# Altium schematic sheet Main.SchDoc
size 420 x 297 mm; SheetNumber: 1; SheetTotal: 6; ENG_APP_DATE: --/--/--; DSN_APP_DATE: --/--/--; CHK_APP_DATE: --/--/--
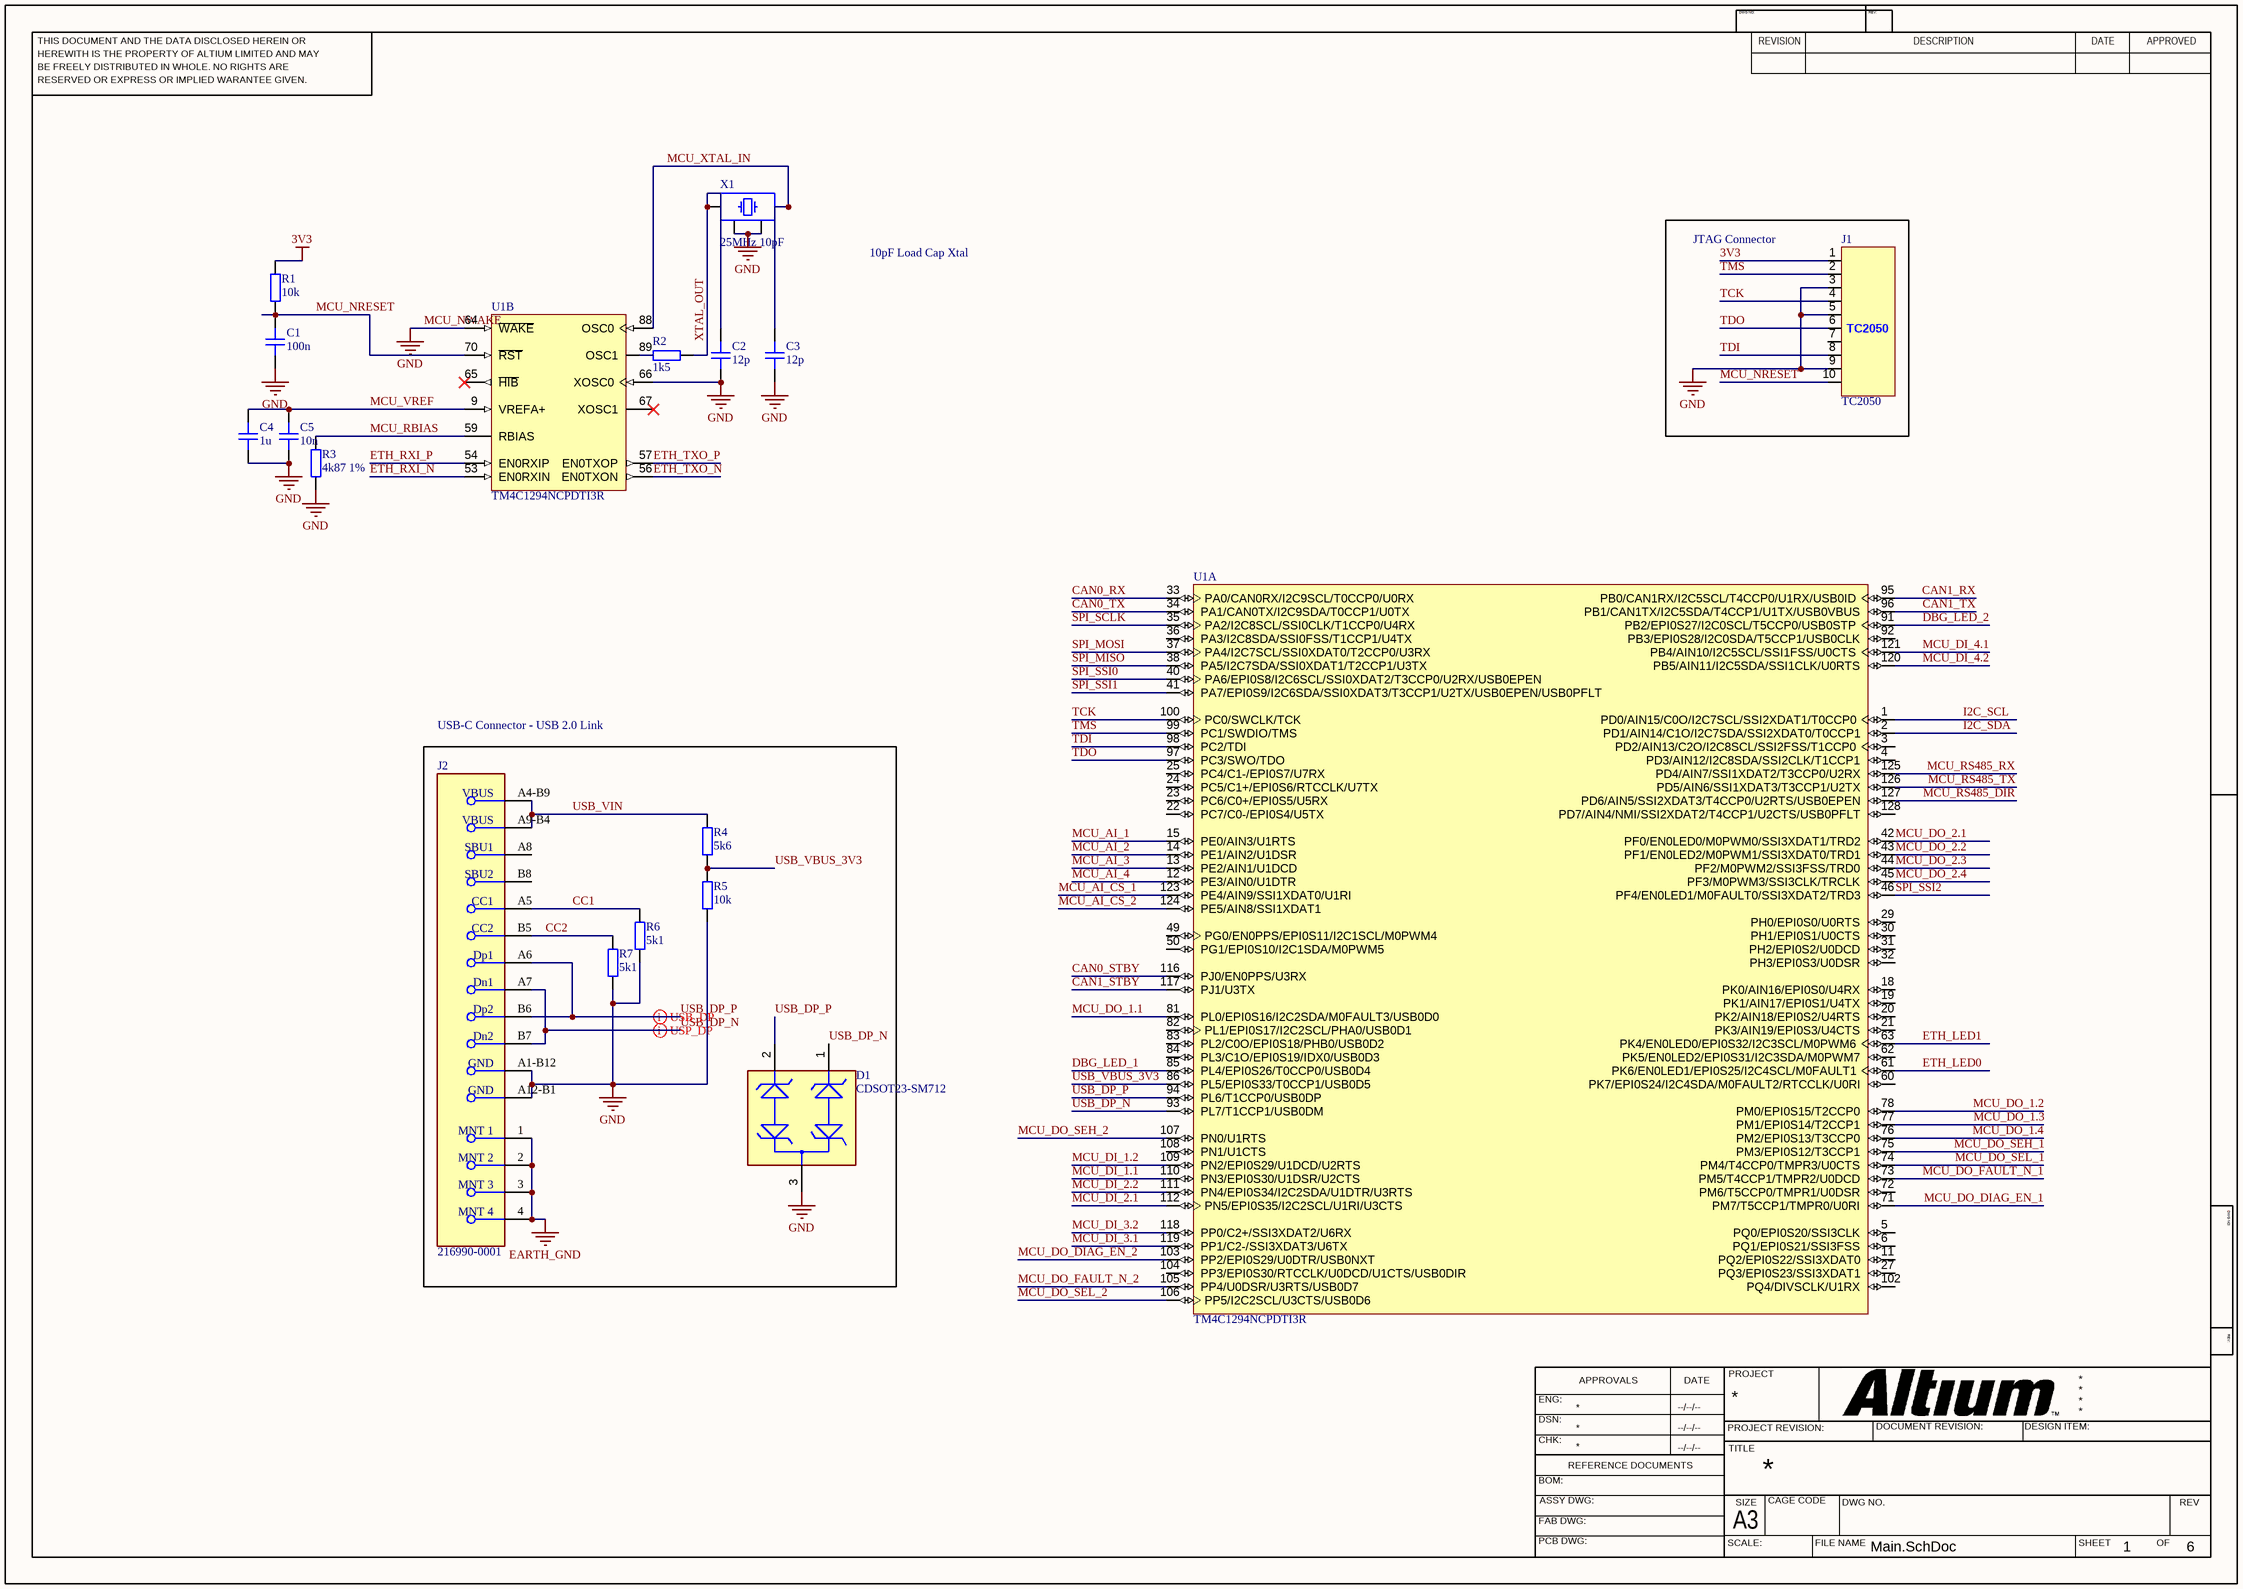
[diagram p0: Main.SchDoc]

## Parts
C1  100n  [CAP_0402]
C2  12p  [CAP_0402]
C3  12p  [CAP_0402]
C4  1u  [CAP_0402]
C5  10n  [CAP_0402]
D1  CDSOT23-SM712  [FP-SOT23-MFG]
J1  TC2050  [TC2050-FP]  (no BOM)
J2  216990-0001  [FP-216990-0001-MFG]
R1  10k  [RES_0402]
R2  1k5  [RES_0402]
R3  4k87 1%  [RES_0402]
R4  5k6  [RES_0402]
R5  10k  [RES_0402]
R6  5k1  [RES_0402]
R7  5k1  [RES_0402]
U1  TM4C1294NCPDTI3R  [PDT0128A_M]  (parts A,B of 3)
X1  25MHz 10pF  [XTAL_3225]

## Blocks framed on the sheet
JTAG Connector: J1
USB-C Connector - USB 2.0 Link: D1 J2 R4-R7

## Nets
3V3: J1.1 R1.1
EARTH_GND: J2.1(MNT_1) J2.2(MNT_2) J2.3(MNT_3) J2.4(MNT_4)
MCU_NWAKE: C1.1 C2.1 C3.1 C4.1 C5.1 D1.3 J1.3 J1.5 J1.9 J2.A1-B12(GND) J2.A12-B1(GND) R3.1 R5.1 R6.1 R7.1 U1.64(~{WAKE}) U1.66(XOSC0) X1.2 X1.4  [also labelled GND]
CAN0_RX: U1.33(PA0/CAN0RX/I2C9SCL/T0CCP0/U0RX)
CAN0_STBY: U1.116(PJ0/EN0PPS/U3RX)
CAN0_TX: U1.34(PA1/CAN0TX/I2C9SDA/T0CCP1/U0TX)
CAN1_RX: U1.95(PB0/CAN1RX/I2C5SCL/T4CCP0/U1RX/USB0ID)
CAN1_STBY: U1.117(PJ1/U3TX)
CAN1_TX: U1.96(PB1/CAN1TX/I2C5SDA/T4CCP1/U1TX/USB0VBUS)
CC1: J2.A5(CC1) R6.2
CC2: J2.B5(CC2) R7.2
DBG_LED_1: U1.85(PL4/EPI0S26/T0CCP0/USB0D4)
DBG_LED_2: U1.91(PB2/EPI0S27/I2C0SCL/T5CCP0/USB0STP)
ETH_LED0: U1.61(PK6/EN0LED1/EPI0S25/I2C4SCL/M0FAULT1)
ETH_LED1: U1.63(PK4/EN0LED0/EPI0S32/I2C3SCL/M0PWM6)
ETH_RXI_N: U1.53(EN0RXIN)
ETH_RXI_P: U1.54(EN0RXIP)
ETH_TXO_N: U1.56(EN0TXON)
ETH_TXO_P: U1.57(EN0TXOP)
I2C_SCL: U1.1(PD0/AIN15/C0O/I2C7SCL/SSI2XDAT1/T0CCP0)
I2C_SDA: U1.2(PD1/AIN14/C1O/I2C7SDA/SSI2XDAT0/T0CCP1)
MCU_AI_1: U1.15(PE0/AIN3/U1RTS)
MCU_AI_2: U1.14(PE1/AIN2/U1DSR)
MCU_AI_3: U1.13(PE2/AIN1/U1DCD)
MCU_AI_4: U1.12(PE3/AIN0/U1DTR)
MCU_AI_CS_1: U1.123(PE4/AIN9/SSI1XDAT0/U1RI)
MCU_AI_CS_2: U1.124(PE5/AIN8/SSI1XDAT1)
MCU_DI_1.1: U1.110(PN3/EPI0S30/U1DSR/U2CTS)
MCU_DI_1.2: U1.109(PN2/EPI0S29/U1DCD/U2RTS)
MCU_DI_2.1: U1.112(PN5/EPI0S35/I2C2SCL/U1RI/U3CTS)
MCU_DI_2.2: U1.111(PN4/EPI0S34/I2C2SDA/U1DTR/U3RTS)
MCU_DI_3.1: U1.119(PP1/C2-/SSI3XDAT3/U6TX)
MCU_DI_3.2: U1.118(PP0/C2+/SSI3XDAT2/U6RX)
MCU_DI_4.1: U1.121(PB4/AIN10/I2C5SCL/SSI1FSS/U0CTS)
MCU_DI_4.2: U1.120(PB5/AIN11/I2C5SDA/SSI1CLK/U0RTS)
MCU_DO_1.1: U1.81(PL0/EPI0S16/I2C2SDA/M0FAULT3/USB0D0)
MCU_DO_1.2: U1.78(PM0/EPI0S15/T2CCP0)
MCU_DO_1.3: U1.77(PM1/EPI0S14/T2CCP1)
MCU_DO_1.4: U1.76(PM2/EPI0S13/T3CCP0)
MCU_DO_2.1: U1.42(PF0/EN0LED0/M0PWM0/SSI3XDAT1/TRD2)
MCU_DO_2.2: U1.43(PF1/EN0LED2/M0PWM1/SSI3XDAT0/TRD1)
MCU_DO_2.3: U1.44(PF2/M0PWM2/SSI3FSS/TRD0)
MCU_DO_2.4: U1.45(PF3/M0PWM3/SSI3CLK/TRCLK)
MCU_DO_DIAG_EN_1: U1.71(PM7/T5CCP1/TMPR0/U0RI)
MCU_DO_DIAG_EN_2: U1.103(PP2/EPI0S29/U0DTR/USB0NXT)
MCU_DO_FAULT_N_1: U1.73(PM5/T4CCP1/TMPR2/U0DCD)
MCU_DO_FAULT_N_2: U1.105(PP4/U0DSR/U3RTS/USB0D7)
MCU_DO_SEH_1: U1.75(PM3/EPI0S12/T3CCP1)
MCU_DO_SEH_2: U1.107(PN0/U1RTS)
MCU_DO_SEL_1: U1.74(PM4/T4CCP0/TMPR3/U0CTS)
MCU_DO_SEL_2: U1.106(PP5/I2C2SCL/U3CTS/USB0D6)
MCU_NRESET: C1.2 J1.10 R1.2 U1.70(~{RST})
MCU_RBIAS: R3.2 U1.59(RBIAS)
MCU_RS485_DIR: U1.127(PD6/AIN5/SSI2XDAT3/T4CCP0/U2RTS/USB0EPEN)
MCU_RS485_RX: U1.125(PD4/AIN7/SSI1XDAT2/T3CCP0/U2RX)
MCU_RS485_TX: U1.126(PD5/AIN6/SSI1XDAT3/T3CCP1/U2TX)
MCU_VREF: C4.2 C5.2 U1.9(VREFA+)
MCU_XTAL_IN: C3.2 U1.88(OSC0) X1.3
SPI_MISO: U1.38(PA5/I2C7SDA/SSI0XDAT1/T2CCP1/U3TX)
SPI_MOSI: U1.37(PA4/I2C7SCL/SSI0XDAT0/T2CCP0/U3RX)
SPI_SCLK: U1.35(PA2/I2C8SCL/SSI0CLK/T1CCP0/U4RX)
SPI_SSI0: U1.40(PA6/EPI0S8/I2C6SCL/SSI0XDAT2/T3CCP0/U2RX/USB0EPEN)
SPI_SSI1: U1.41(PA7/EPI0S9/I2C6SDA/SSI0XDAT3/T3CCP1/U2TX/USB0EPEN/USB0PFLT)
SPI_SSI2: U1.46(PF4/EN0LED1/M0FAULT0/SSI3XDAT2/TRD3)
TCK: J1.4 U1.100(PC0/SWCLK/TCK)
TDI: J1.8 U1.98(PC2/TDI)
TDO: J1.6 U1.97(PC3/SWO/TDO)
TMS: J1.2 U1.99(PC1/SWDIO/TMS)
USB_DP_N: D1.1 J2.A7(Dn1) J2.B7(Dn2) U1.93(PL7/T1CCP1/USB0DM)
USB_DP_P: D1.2 J2.A6(Dp1) J2.B6(Dp2) U1.94(PL6/T1CCP0/USB0DP)
USB_VBUS_3V3: R4.1 R5.2 U1.86(PL5/EPI0S33/T0CCP1/USB0D5)
USB_VIN: J2.A4-B9(VBUS) J2.A9-B4(VBUS) R4.2
XTAL_OUT: C2.2 R2.2 X1.1
NetR2_1: R2.1 U1.89(OSC1)

Not connected (* = marked no-connect by the designer): J1 7; J2 A8(SBU1) B8(SBU2); U1 3(PD2/AIN13/C2O/I2C8SCL/SSI2FSS/T1CCP0) 4(PD3/AIN12/I2C8SDA/SSI2CLK/T1CCP1) 5(PQ0/EPI0S20/SSI3CLK) 6(PQ1/EPI0S21/SSI3FSS) 11(PQ2/EPI0S22/SSI3XDAT0) 18(PK0/AIN16/EPI0S0/U4RX) 19(PK1/AIN17/EPI0S1/U4TX) 20(PK2/AIN18/EPI0S2/U4RTS) 21(PK3/AIN19/EPI0S3/U4CTS) 22(PC7/C0-/EPI0S4/U5TX) 23(PC6/C0+/EPI0S5/U5RX) 24(PC5/C1+/EPI0S6/RTCCLK/U7TX) 25(PC4/C1-/EPI0S7/U7RX) 27(PQ3/EPI0S23/SSI3XDAT1) 29(PH0/EPI0S0/U0RTS) 30(PH1/EPI0S1/U0CTS) 31(PH2/EPI0S2/U0DCD) 32(PH3/EPI0S3/U0DSR) 36(PA3/I2C8SDA/SSI0FSS/T1CCP1/U4TX) 49(PG0/EN0PPS/EPI0S11/I2C1SCL/M0PWM4) 50(PG1/EPI0S10/I2C1SDA/M0PWM5) 60(PK7/EPI0S24/I2C4SDA/M0FAULT2/RTCCLK/U0RI) 62(PK5/EN0LED2/EPI0S31/I2C3SDA/M0PWM7) 65(~{HIB})* 67(XOSC1)* 72(PM6/T5CCP0/TMPR1/U0DSR) 82(PL1/EPI0S17/I2C2SCL/PHA0/USB0D1) 83(PL2/C0O/EPI0S18/PHB0/USB0D2) 84(PL3/C1O/EPI0S19/IDX0/USB0D3) 92(PB3/EPI0S28/I2C0SDA/T5CCP1/USB0CLK) 102(PQ4/DIVSCLK/U1RX) 104(PP3/EPI0S30/RTCCLK/U0DCD/U1CTS/USB0DIR) 108(PN1/U1CTS) 128(PD7/AIN4/NMI/SSI2XDAT2/T4CCP1/U2CTS/USB0PFLT)

## Layout directives
differential pair; differential pair class USB: USB_DP_N, USB_DP_P

## Notes on the sheet
- 10pF Load Cap Xtal
- THIS DOCUMENT AND THE DATA DISCLOSED HEREIN OR
- HEREWITH IS THE PROPERTY OF ALTIUM LIMITED AND MAY
- DWG NO:
- REVISION
- REV:
- DESCRIPTION
- DATE
- APPROVED
- BE FREELY DISTRIBUTED IN WHOLE. NO RIGHTS ARE
- RESERVED OR EXPRESS OR IMPLIED WARANTEE GIVEN.
- ENG:
- APPROVALS
- PROJECT
- DSN:
- CHK:
- REFERENCE DOCUMENTS
- PROJECT REVISION:
- TITLE
- DOCUMENT REVISION:
- DESIGN ITEM:
- BOM:
- FAB DWG:
- PCB DWG:
- ASSY DWG:
- SCALE:
- A3
- SIZE
- CAGE CODE
- FILE NAME
- DWG NO.
- SHEET
- OF
- REV

## Library data of the parts
C1-C5 = CAP_0402: Capacitor SMD 0402; Manufacturer: *; Manufacturer Part Number: *; Distributor Link: *; LCSC: *; Rating: *; Dielectric: *
D1 = CMP-2000-05081-2: TVS DIODE 5V; Manufacturer: Bourns Inc.; Peak Pulse Current: 17A; Standoff Height: 0.05mm; Breakdown Voltage: 7.5V; Direction: Bidirectional; Clamping Voltage: 26V; Value: 75pF; Number Of Channels: 2; Reverse Standoff Voltage: 12V; Peak Pulse Power: 400W; Temperature Range Low: -55°C; Mouser Description: Transient Voltage Suppressor, TVS, CDSOT23 Series, Unidirectional, 12 V, SOT-23, 3, 13.3 V; Device Class L3: unset; Package: SOT23; Height: 1.17mm; RoHS: TRUE; Octopart: https://octopart.com/cdsot23-sm712-bourns-7576327; Category: Diode; Ipc Land Pattern Name: SOT95P229X103-3; ComponentLink2URL: https://www.bourns.com/docs/Product-Datasheets/CDSOT23-SM712.pdf; Temperature Range High: +150°C; ComponentLink2Description: Datasheet; Digikey Description: TVS DIODE 7V/12V 14V/26V SOT23-3; Manufacturer Part Number: CDSOT23-SM712; Temperature: -55°C to +150°C; Device Class L2: TVS Diodes; Lead Free: Yes; Device Class L1: Circuit Protection; Automotive: No; Capacitance: 75pF
J1 = TC2050: Tag-Connect No-Solder SWD Debug Connector DO NOT PLACE; Manufacturer: Tag-Connect; Manufacturer Part Number: TC2050
J2 = CMP-04767-000014-1: CONN RCP USB2.0 TYP C 24P SMD RA
R1-R7 = RES_0402: Resistor SMD 0402; Manufacturer: *; Manufacturer Part Number: *; Distributor Link: *; LCSC: *
U1 = CMP-0945-00007-2: Tiva C Series Microcontroller, 1024 KB Flash, 256 KB SRAM, 12 Bit, 20 Channels, -40 to 85 degC, 128-Pin TQFP (PDT), Green (RoHS & no Sb/Br), Tape and Reel; Manufacturer: Texas Instruments; SRAM: 256 KB; ADC Resolution: 12 Bits; Max Speed: 120 MHz; CPU: ARM Cortex-M4; ADC Channels: 20; Flash: 1024 KB; ComponentLink1Description: Manufacturer URL; PartNumber: TM4C1294NCPDTI3R; ComponentLink2URL: http://www.ti.com/lit/ds/symlink/tm4c1294ncpdt.pdf; ComponentLink1URL: http://www.ti.com/; Packing: Tape and Reel; PackageReference: PDT0128A; PackageVersion: 4087726/A; Temperature Range: -40 to 85 degC; ComponentLink2Description: Datasheet; DatasheetVersion: 15863.2743; ComponentLink3URL: http://www.ti.com/lit/ml/mpqf013/mpqf013.pdf; ComponentLink3Description: Package Specification; Mounting Technology: Surface Mount; Eco-Plan: Green (RoHS & no Sb/Br); PackageDescription: 128-Pin Thin Quad Flat Package, Body 14 x 14 mm, Pitch 0.4 mm
X1 = TSX-3225_24.0000MF15X-AC: Crystal SMD 24MHz 10PPM 7pF 3225; Manufacturer: Epson; Manufacturer Part Number: TSX-3225 24.0000MF15X-AC